# Altium schematic sheet GimbalFPV.SchDoc
size A4; SheetNumber: 4; SheetTotal: 4
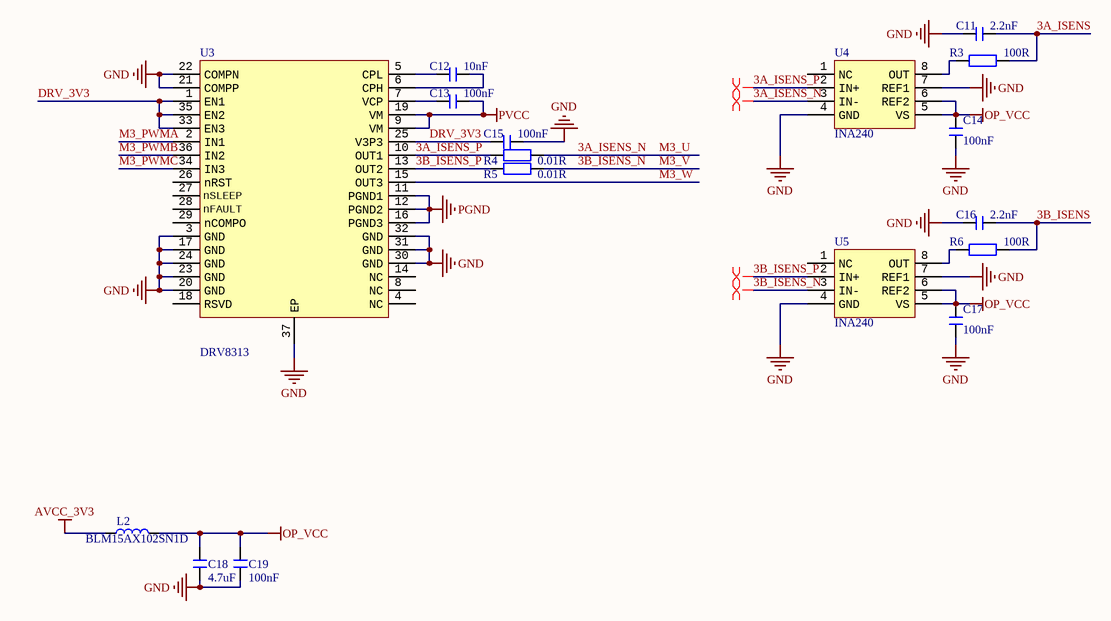
[diagram p0: GimbalFPV.SchDoc]

## Parts
C11  2.2nF  [C 0402_L]
C12  10nF  [C 0402_L]
C13  100nF  [C 0402_L]
C14  100nF  [C 0402_L]
C15  100nF  [C 0402_L]
C16  2.2nF  [C 0402_L]
C17  100nF  [C 0402_L]
C18  4.7uF  [C 0402_L]
C19  100nF  [C 0402_L]
L2  BLM15AX102SN1D  [L 0402]
R3  100R  [R 0402_L]
R4  0.01R  [RI 1206]
R5  0.01R  [RI 1206]
R6  100R  [R 0402_L]
U3  DRV8313  [VQFN-36-6X6]
U4  INA240  [SSOP8_L]
U5  INA240  [SSOP8_L]

## Nets
AVCC_3V3: L2.1
GND: C11.1 C14.1 C15.2 C16.1 C17.1 C18.1 C19.1 U3.3(GND) U3.17(GND) U3.20(GND) U3.21(COMPP) U3.22(COMPN) U3.23(GND) U3.24(GND) U3.30(GND) U3.31(GND) U3.32(GND) U3.37(EP) U4.4(GND) U4.7(REF1) U5.4(GND) U5.7(REF1)
OP_VCC: C14.2 C17.2 C18.2 C19.2 L2.2 U4.5(VS) U4.6(REF2) U5.5(VS) U5.6(REF2)
PGND: U3.11(PGND1) U3.12(PGND2) U3.16(PGND3)
PVCC: C13.2 U3.9(VM) U3.19(VM)
3A_ISENS: C11.2 R3.2
3A_ISENS_N: R4.2 U4.3(IN-)  [also labelled M3_U]
3A_ISENS_P: R4.1 U3.10(OUT1) U4.2(IN+)
3B_ISENS: C16.2 R6.2
3B_ISENS_N: R5.2 U5.3(IN-)  [also labelled M3_V]
3B_ISENS_P: R5.1 U3.13(OUT2) U5.2(IN+)
DRV_3V3: C15.1 U3.1(EN1) U3.25(V3P3) U3.33(EN3) U3.35(EN2)
M3_PWMA: U3.2(IN1)
M3_PWMB: U3.36(IN2)
M3_PWMC: U3.34(IN3)
M3_W: U3.15(OUT3)
NetC12_1: C12.1 U3.5(CPL)
NetC12_2: C12.2 U3.6(CPH)
NetC13_1: C13.1 U3.7(VCP)
NetR3_1: R3.1 U4.8(OUT)
NetR6_1: R6.1 U5.8(OUT)

Not connected (* = marked no-connect by the designer): U3 4(NC) 8(NC) 14(NC) 18(RSVD) 26(nRST) 27(nSLEEP) 28(nFAULT) 29(nCOMPO); U4 1(NC); U5 1(NC)

## Layout directives
differential pair: 3A_ISENS_N, 3A_ISENS_P, 3B_ISENS_N, 3B_ISENS_P

## Library data of the parts
C11-C19 = C: 无极性贴片电容; 版权归属: 源创客; BOM名称: 无极性贴片电容; 学习资源: www.ooocke.com
L2 = L: 小功率贴片电感; 版权归属: 源创客; BOM名称: 小功率贴片电感; 学习资源: www.ooocke.com
R3 R6 = R: 贴片电阻; 版权归属: 源创客; BOM名称: 贴片电阻; 学习资源: www.ooocke.com
R4 R5 = R-I: 电流检测电阻; 版权归属: 源创客; BOM名称: 电流检测电阻; 学习资源: www.ooocke.com
U3 = DRV8313: 集成FET的3路半桥驱动器 / 3A
U4 U5 = INA240: PWM抑制电流检测芯片